# Altium schematic sheet Headlight_Left_Board.SchDoc: Left Headlights
size Letter; Organization: Midnight Sun Solar Rayce Car Team; Address1: University of Waterloo; Address2: 200 University Ave W; Address3: Waterloo, ON, Canada; Address4: N2L 3E9; DocumentNumber: 4; SheetNumber: 4; SheetTotal: 5; Website: www.uwmidsun.com
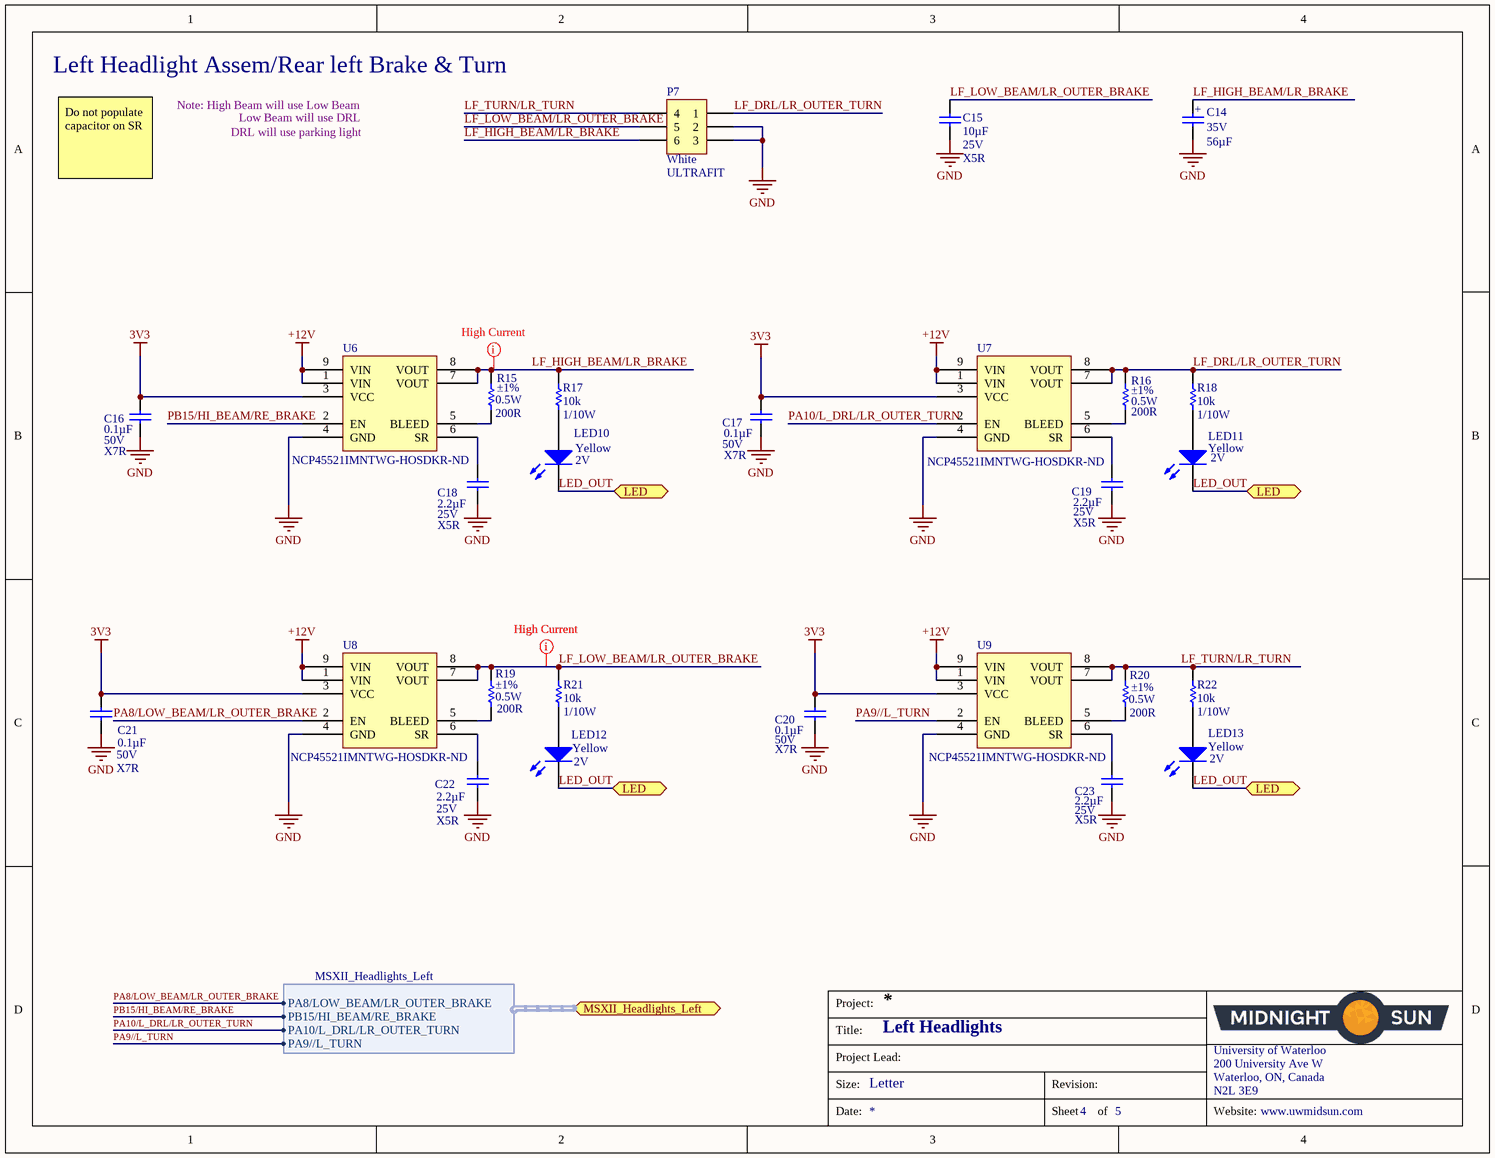
[diagram p0: Headlight_Left_Board.SchDoc]

## Parts
C14  Voltage: 35V  Capacitance: 56µF  [CAP ALUM 56UF 20% 35V RADIAL]  (hidden comment: CAP ALUM 56UF 20% 35V RADIAL)
C15  Capacitance: 10µF  Voltage: 25V  Temperature Coefficient: X5R  [CAP, 0603]  (hidden comment: CAP CER 10uF 25V 20% X5R 0603)
C16  Capacitance: 0.1µF  Voltage: 50V  Temperature Coefficient: X7R  [CAP, 0603]  (hidden comment: CAP CER 0.1UF 50V 10% X7R 0603)
C17  Capacitance: 0.1µF  Voltage: 50V  Temperature Coefficient: X7R  [CAP, 0603]  (hidden comment: CAP CER 0.1UF 50V 10% X7R 0603)
C18  Capacitance: 2.2µF  Voltage: 25V  Temperature Coefficient: X5R  [CAP, 0603]  (hidden comment: CAP CER 2.2UF 25V 10% X5R 0603)  (no BOM)
C19  Capacitance: 2.2µF  Voltage: 25V  Temperature Coefficient: X5R  [CAP, 0603]  (hidden comment: CAP CER 2.2UF 25V 10% X5R 0603)  (no BOM)
C20  Capacitance: 0.1µF  Voltage: 50V  Temperature Coefficient: X7R  [CAP, 0603]  (hidden comment: CAP CER 0.1UF 50V 10% X7R 0603)
C21  Capacitance: 0.1µF  Voltage: 50V  Temperature Coefficient: X7R  [CAP, 0603]  (hidden comment: CAP CER 0.1UF 50V 10% X7R 0603)
C22  Capacitance: 2.2µF  Voltage: 25V  Temperature Coefficient: X5R  [CAP, 0603]  (hidden comment: CAP CER 2.2UF 25V 10% X5R 0603)  (no BOM)
C23  Capacitance: 2.2µF  Voltage: 25V  Temperature Coefficient: X5R  [CAP, 0603]  (hidden comment: CAP CER 2.2UF 25V 10% X5R 0603)  (no BOM)
LED10  Color: Yellow  Voltage - Forward (Vf) (Typ): 2V  [LED_0603]  (hidden comment: LED YELLOW CLEAR 2.1V 0603)
LED11  Color: Yellow  Voltage - Forward (Vf) (Typ): 2V  [LED_0603]  (hidden comment: LED YELLOW CLEAR 2.1V 0603)
LED12  Color: Yellow  Voltage - Forward (Vf) (Typ): 2V  [LED_0603]  (hidden comment: LED YELLOW CLEAR 2.1V 0603)
LED13  Color: Yellow  Voltage - Forward (Vf) (Typ): 2V  [LED_0603]  (hidden comment: LED YELLOW CLEAR 2.1V 0603)
P7  Insulation Color: White  Series: ULTRAFIT  [CONN, 6POS ULTRA-FIT - NATURAL COLOR]  (hidden comment: CONN 6POS ULTRA-FIT NATURAL COLOR 0.138")
R15  value 200R  Tolerance: ±1%  Power (Watts): 0.5W  [RES 0805]  (hidden comment: RES SMD 200 OHM 1% 1/2W 0805)
R16  value 200R  Tolerance: ±1%  Power (Watts): 0.5W  [RES 0805]  (hidden comment: RES SMD 200 OHM 1% 1/2W 0805)
R17  Resistance: 10k  Power: 1/10W  [RES, 0603]  (hidden comment: RES 10K OHM 1% 1/10W 0603)
R18  Resistance: 10k  Power: 1/10W  [RES, 0603]  (hidden comment: RES 10K OHM 1% 1/10W 0603)
R19  value 200R  Tolerance: ±1%  Power (Watts): 0.5W  [RES 0805]  (hidden comment: RES SMD 200 OHM 1% 1/2W 0805)
R20  value 200R  Tolerance: ±1%  Power (Watts): 0.5W  [RES 0805]  (hidden comment: RES SMD 200 OHM 1% 1/2W 0805)
R21  Resistance: 10k  Power: 1/10W  [RES, 0603]  (hidden comment: RES 10K OHM 1% 1/10W 0603)
R22  Resistance: 10k  Power: 1/10W  [RES, 0603]  (hidden comment: RES 10K OHM 1% 1/10W 0603)
U6  Supplier Part Number 2: NCP45521IMNTWG-HOSDKR-ND  [IC LOAD SWITCH ACT-HI 10.5A 8DFN]  (hidden comment: IC LOAD SWITCH ACT-HI 10.5A 8DFN)
U7  Supplier Part Number 2: NCP45521IMNTWG-HOSDKR-ND  [IC LOAD SWITCH ACT-HI 10.5A 8DFN]  (hidden comment: IC LOAD SWITCH ACT-HI 10.5A 8DFN)
U8  Supplier Part Number 2: NCP45521IMNTWG-HOSDKR-ND  [IC LOAD SWITCH ACT-HI 10.5A 8DFN]  (hidden comment: IC LOAD SWITCH ACT-HI 10.5A 8DFN)
U9  Supplier Part Number 2: NCP45521IMNTWG-HOSDKR-ND  [IC LOAD SWITCH ACT-HI 10.5A 8DFN]  (hidden comment: IC LOAD SWITCH ACT-HI 10.5A 8DFN)

## Ports
LED, MSXII_Headlights_Left (harness MSXII_Headlights_Left)

## Harnesses
MSXII_Headlights_Left: PA8/LOW_BEAM/LR_OUTER_BRAKE, PB15/HI_BEAM/RE_BRAKE, PA10/L_DRL/LR_OUTER_TURN, PA9//L_TURN

## Nets
3V3: C16.1 C17.1 C20.1 C21.1 U6.3(VCC) U7.3(VCC) U8.3(VCC) U9.3(VCC)
+12V: U6.1(VIN) U6.9(VIN) U7.1(VIN) U7.9(VIN) U8.1(VIN) U8.9(VIN) U9.1(VIN) U9.9(VIN)
GND: C14.2 C15.1 C16.2 C17.2 C18.2 C19.2 C20.2 C21.2 C22.2 C23.2 P7.2 P7.3 U6.4(GND) U7.4(GND) U8.4(GND) U9.4(GND)
LED_OUT: LED10.2(K) LED11.2(K) LED12.2(K) LED13.2(K) ; port LED
LF_DRL/LR_OUTER_TURN: P7.1 R16.1 R18.1 U7.7(VOUT) U7.8(VOUT)
LF_HIGH_BEAM/LR_BRAKE: C14.1 P7.6 R15.1 R17.1 U6.7(VOUT) U6.8(VOUT)
LF_LOW_BEAM/LR_OUTER_BRAKE: C15.2 P7.5 R19.1 R21.1 U8.7(VOUT) U8.8(VOUT)
LF_TURN/LR_TURN: P7.4 R20.1 R22.1 U9.7(VOUT) U9.8(VOUT)
PA8/LOW_BEAM/LR_OUTER_BRAKE: U8.2(EN) ; port MSXII_Headlights_Left.PA8/LOW_BEAM/LR_OUTER_BRAKE
PA9//L_TURN: U9.2(EN) ; port MSXII_Headlights_Left.PA9//L_TURN
PA10/L_DRL/LR_OUTER_TURN: U7.2(EN) ; port MSXII_Headlights_Left.PA10/L_DRL/LR_OUTER_TURN
PB15/HI_BEAM/RE_BRAKE: U6.2(EN) ; port MSXII_Headlights_Left.PB15/HI_BEAM/RE_BRAKE
NetC18_1: C18.1 U6.6(SR)
NetC19_1: C19.1 U7.6(SR)
NetC22_1: C22.1 U8.6(SR)
NetC23_1: C23.1 U9.6(SR)
NetLED10_1: LED10.1(A) R17.2
NetLED11_1: LED11.1(A) R18.2
NetLED12_1: LED12.1(A) R21.2
NetLED13_1: LED13.1(A) R22.2
NetR15_2: R15.2 U6.5(BLEED)
NetR16_2: R16.2 U7.5(BLEED)
NetR19_2: R19.2 U8.5(BLEED)
NetR20_2: R20.2 U9.5(BLEED)

## Layout directives
rule Power Plane Connect Style [Style - Direct Connect]: LF_HIGH_BEAM/LR_BRAKE, LF_LOW_BEAM/LR_OUTER_BRAKE
net class High Current: LF_LOW_BEAM/LR_OUTER_BRAKE

## Notes on the sheet
- Left Headlight Assem/Rear left Brake & Turn
- Note: High Beam will use Low Beam
- DRL will use parking light
- Low Beam will use DRL
- Do not populate capacitor on SR
- Project:
- Title:
- Size:
- Project Lead:
- Letter
- Revision:
- University of Waterloo
- 200 University Ave W
- Waterloo, ON, Canada
- N2L 3E9
- Date:
- Sheet
- of
- Website:
- (in symbol CAP ALUM 56UF 20% 35V RADIAL) +

## Library data of the parts
C14 = CAP ALUM 56UF 20% 35V RADIAL: 56µF 35V Aluminum Electrolytic Capacitors Radial, Can 1000 Hrs @ 105°C; Manufacturer: Panasonic Electronic Components; Manufacturer Part Number: EEU-FC1V560H; Polarization: Polar; Supplier 1: Digi-Key; RoHS: RoHS Compliant; Category: Capacitors; Stock 1: 21680; Pricing 1: 1=0.49, 10=0.347, 100=0.2082, 500=0.15622, 1000=0.13193 (CAD); Packaging: Cut Tape (CT); Part Status: Active; ESR (Equivalent Series Resistance): -; Lifetime @ Temp.: 1000 Hrs @ 105°C; Operating Temperature: -55°C ~ 105°C; Ratings: AEC-Q200; Applications: Automotive; Lead Spacing: 0.098" (2.50mm); Size / Dimension: 0.248" Dia (6.30mm); Height - Seated (Max): 0.480" (12.20mm); Surface Mount Land Size: -; Mounting Type: Through Hole; Package / Case: Radial, Can; ComponentLink1URL: http://industrial.panasonic.com/www-cgi/jvcr13pz.cgi?E+PZ+3+ABA0022+EEUFC1V560H+7+WW; ComponentLink1Description: http://industrial.panasonic.com/www-cgi/jvcr13pz.cgi?E+PZ+3+ABA0022+EEUFC1V560H+7+WW; Supplier Part Number 1: P19684CT-ND
C15 = CAP CER 10uF 25V 20% X5R 0603: 10µF ±20% 25V Ceramic Capacitor X5R 0603 (1608 Metric); Manufacturer 1: Murata Electronics North America; Manufacturer Part Number 1: GRM188R61E106MA73D; Supplier 1: Digi-Key; Supplier Part Number 1: 490-7202-1-ND; Packaging: Cut Tape (CT); Part Status: Active; Operating Temperature: -55°C ~ 85°C; Ratings: -; Mounting Type: Surface Mount, MLCC; Package / Case: 0603 (1608 Metric); Size / Dimension: 0.063" L x 0.031" W (1.60mm x 0.80mm); Height - Seated (Max): -; Thickness (Max): 0.031" (0.80mm); Lead Spacing: -; Lead Style: -; ComponentLink1URL: http://www.murata.com/~/media/webrenewal/support/library/catalog/products/capacitor/mlcc/c02e.ashx; ComponentLink1Description: http://www.murata.com/~/media/webrenewal/support/library/catalog/products/capacitor/mlcc/c02e.ashx; Tolerance: ±20%
C16 C17 C20 C21 = CAP CER 0.1UF 50V 10% X7R 0603: 0.10µF ±10% 50V Ceramic Capacitor X7R 0603 (1608 Metric); Manufacturer 1: AVX Corporation; Manufacturer Part Number 1: 06035C104KAT2A; Supplier 1: Digi-Key; Supplier Part Number 1: 478-5052-1-ND; Packaging: Cut Tape (CT); Part Status: Active; Operating Temperature: -55°C ~ 125°C; Ratings: -; Mounting Type: Surface Mount, MLCC; Package / Case: 0603 (1608 Metric); Size / Dimension: 0.063" L x 0.032" W (1.60mm x 0.81mm); Height - Seated (Max): -; Thickness (Max): 0.035" (0.90mm); Lead Spacing: -; Lead Style: -; ComponentLink1URL: http://datasheets.avx.com/X7RDielectric.pdf; ComponentLink1Description: http://datasheets.avx.com/X7RDielectric.pdf; Tolerance: ±10%
C18 C19 C22 C23 = CAP CER 2.2UF 25V 10% X5R 0603: 2.2µF ±10% 25V Ceramic Capacitor X5R 0603 (1608 Metric); Manufacturer 1: Murata Electronics North America; Manufacturer Part Number 1: GRM188R61E225KA12D; Supplier 1: Digi-Key; Supplier Part Number 1: 490-10731-1-ND; Packaging: Cut Tape (CT); Part Status: Active; Operating Temperature: -55°C ~ 85°C; Ratings: -; Mounting Type: Surface Mount, MLCC; Package / Case: 0603 (1608 Metric); Size / Dimension: 0.063" L x 0.031" W (1.60mm x 0.80mm); Height - Seated (Max): -; Thickness (Max): 0.035" (0.90mm); Lead Spacing: -; Lead Style: -; ComponentLink1URL: http://www.murata.com/~/media/webrenewal/support/library/catalog/products/capacitor/mlcc/c02e.ashx; ComponentLink1Description: http://www.murata.com/~/media/webrenewal/support/library/catalog/products/capacitor/mlcc/c02e.ashx; Tolerance: ±10%
LED10-LED13 = LED YELLOW CLEAR 2.1V 0603: Yellow 590nm LED Indication - Discrete 2V 0603 (1608 Metric); Manufacturer: Wurth Electronics Inc.; Manufacturer Part Number: 150060YS75000; Lens Color: Colorless; Millicandela Rating: 120mcd; Lens Style/Size: Rectangle with Flat Top, 1.10mm x 0.70mm; Current - Test: 20mA; Viewing Angle: 140°; Wavelength - Peak: 595nm; Supplier 1: Digi-Key; RoHS: RoHS Compliant; Category: Optoelectronics; Stock 1: 10523; Pricing 1: 1=0.21, 100=0.1617, 500=0.13964 (CAD); Packaging: Cut Tape (CT); Part Status: Active; Lens Transparency: Clear; Mounting Type: Surface Mount; Wavelength - Dominant: 590nm; Features: -; Package / Case: 0603 (1608 Metric); Supplier Device Package: 0603; Size / Dimension: 1.60mm L x 0.80mm W; Height (Max): 0.80mm; ComponentLink1URL: http://katalog.we-online.de/led/datasheet/150060YS75000.pdf; ComponentLink1Description: http://katalog.we-online.de/led/datasheet/150060YS75000.pdf; Supplier Part Number 1: 732-4981-1-ND
P7 = CONN 6POS ULTRA-FIT NATURAL COLOR 0.138": 6 Positions Header Connector 0.138" (3.50mm) Through Hole Tin; Manufacturer 1: Molex, LLC; Manufacturer Part Number 1: 1722992106; Description 1: ULTRAFIT VERT TIN PLATED NAT; Style: Board to Cable/Wire; Shrouding: Shrouded - 4 Wall; Number of Positions: 6; Number of Positions Loaded: All; Row Spacing - Mating: 0.181" (4.60mm); Contact Length - Post: 0.126" (3.20mm); Material Flammability Rating: UL94 V-0; Voltage Rating: 400V; Mated Stacking Heights: 26.99mm; Supplier 1: Digi-Key; Supplier Part Number 1: WM11799-ND; RoHS: RoHS Compliant; Category: Connectors, Interconnects; Stock 1: 315; Pricing 1: 1=1.85, 10=1.617, 50=1.4586, 100=1.395, 250=1.26816, 500=1.14134, 1000=1.01453, 2500=0.91942, 5000=0.88771 (CAD); Packaging: Tray; Part Status: Active; Connector Type: Header; Contact Type: Male Pin; Pitch - Mating: 0.138" (3.50mm); Number of Rows: 2; Mounting Type: Through Hole; Termination: Solder; Fastening Type: Latch Holder; Contact Length - Mating: -; Overall Contact Length: -; Insulation Height: 0.465" (11.80mm); Contact Shape: Square; Contact Finish - Mating: Tin; Contact Finish Thickness - Mating: 60µin (1.52µm); Contact Finish - Post: Tin; Contact Material: Copper Alloy; Insulation Material: Liquid Crystal Polymer (LCP); Features: Board Guide, Solder Retention; Operating Temperature: -40°C ~ 105°C; Ingress Protection: -; Current Rating: -; Contact Finish Thickness - Post: 60µin (1.52µm); Applications: Automotive, General Purpose, Industrial, Lighting, Medical, Military, Telecommunications; ComponentLink1URL: http://www.molex.com/pdm_docs/sd/1722992106_sd.pdf; ComponentLink1Description: http://www.molex.com/pdm_docs/sd/1722992106_sd.pdf
R15 R16 R19 R20 = RES SMD 200 OHM 1% 1/2W 0805: 200 Ohms ±1% 0.5W, 1/2W Chip Resistor 0805 (2012 Metric) Automotive AEC-Q200, Pulse Withstanding Thick Film; Manufacturer: Panasonic Electronic Components; Manufacturer Part Number: ERJ-P06F2000V; Temperature Coefficient: ±100ppm/°C; Supplier 1: Digi-Key; RoHS: RoHS Compliant; Category: Resistors; Stock 1: 46246; Pricing 1: 1=0.27, 10=0.226, 100=0.0884, 1000=0.03699, 2500=0.0339 (CAD); Packaging: Cut Tape (CT); Part Status: Active; Composition: Thick Film; Features: Automotive AEC-Q200, Pulse Withstanding; Operating Temperature: -55°C ~ 155°C; Package / Case: 0805 (2012 Metric); Supplier Device Package: 0805; Size / Dimension: 0.079" L x 0.049" W (2.00mm x 1.25mm); Height - Seated (Max): 0.028" (0.70mm); Failure Rate: -; ComponentLink1URL: https://industrial.panasonic.com/cdbs/www-data/pdf/RDO0000/AOA0000C331.pdf; ComponentLink1Description: https://industrial.panasonic.com/cdbs/www-data/pdf/RDO0000/AOA0000C331.pdf
R17 R18 R21 R22 = RES 10K OHM 1% 1/10W 0603: RES SMD 10K OHM 1% 1/10W 0603; Manufacturer 1: Yageo; Manufacturer Part Number 1: RC0603FR-0710KL; Temperature Coefficient: ±100ppm/°C; Supplier 1: Digi-Key; Supplier Part Number 1: 311-10.0KHRCT-ND; Packaging: Cut Tape (CT); Part Status: Active; Composition: Thick Film; Operating Temperature: -55°C ~ 155°C; Package / Case: 0603 (1608 Metric); Supplier Device Package: 0603; Size / Dimension: 0.063" L x 0.031" W (1.60mm x 0.80mm); Height - Seated (Max): 0.022" (0.55mm); Failure Rate: -; ComponentLink1URL: http://www.yageo.com/documents/recent/PYu-RC_Group_51_RoHS_L_7.pdf; ComponentLink1Description: http://www.yageo.com/documents/recent/PYu-RC_Group_51_RoHS_L_7.pdf; Tolerance: ±1%
U6-U9 = IC LOAD SWITCH ACT-HI 10.5A 8DFN: NCP45521IMNTWG-H; Manufacturer: ON Semiconductor; Switch Type: General Purpose; Number of Outputs: 1; Ratio - Input:Output: 1:1; Output Configuration: High Side; Output Type: N-Channel; Interface: On/Off; Voltage - Load: 0.5 V ~ 13.5 V; Voltage - Supply (Vcc/Vdd): 3 V ~ 5.5 V; Rds On (Typ): 12.8 mOhm; Input Type: Non-Inverting; Fault Protection: Over Temperature, UVLO; Manufacturer Part Number: NCP45521IMNTWG-H; RoHS: RoHS Compliant; Category: Integrated Circuits (ICs); Packaging: Digi-Reel®; Part Status: Active; Current - Output (Max): 10.5A; Features: Slew Rate Controlled; Operating Temperature: -40°C ~ 85°C (TA); Package / Case: 8-VFDFN Exposed Pad; Supplier Device Package: 8-DFN (2x2); ComponentLink1URL: http://www.onsemi.com/pub/Collateral/NCP45520-D.PDF; ComponentLink1Description: http://www.onsemi.com/pub/Collateral/NCP45520-D.PDF; Supplier 1: Digi-Key; Stock 1: 2377; Pricing 1: 1=1.57, 10=1.405, 100=1.0957, 500=0.90518, 1000=0.71462 (CAD); Supplier 2: Digi-Key; Stock 2: 2211; Pricing 2: 1=1.53, 10=1.372, 100=1.0702, 500=0.88408, 1000=0.69797 (CAD)